# EAGLE design Breakout (EAGLE 9.6.2)

## Sheet 1 of 2
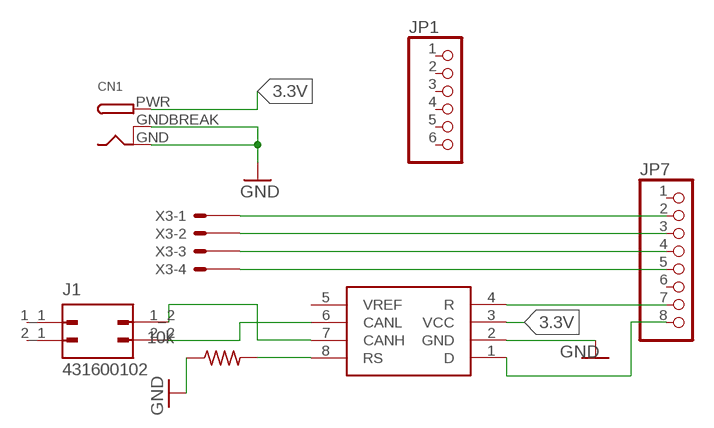
[diagram p0: schematic, sheet 1]

### Parts
CN1  DCBARRELPTH  [DCJACK_2MM_PTH]
IC1  SN65HVD231D  [SOIC127P600X175-8N]
J1  431600102  [MOLEX_431600102]
JP1  PINHD-1X6  [1X06]
JP7  PINHD-1X8  [1X08]
R5  10k  R-US_0204/5  [0204/5]
X3  43160-5304  [43160-XX04]

### Nets
3.3V: CN1.PWR IC1.3(VCC)
GND: CN1.GND CN1.GNDBREAK IC1.2(GND) R5.1
N$1: IC1.1(D) JP7.8
N$2: IC1.4(R) JP7.7
N$5: IC1.8(RS) R5.2
N$6: JP7.5 X3.4@1(-4:S)
N$7: JP7.4 X3.3@1(-3:S)
N$8: JP7.3 X3.2@1(-2:S)
N$9: JP7.2 X3.1@1(-1:S)
SIG_N: IC1.6(CANL) J1.2_2
SIG_P: IC1.7(CANH) J1.1_2
Unconnected: IC1.5(VREF) J1.1_1 J1.2_1 JP1.1 JP1.2 JP1.3 JP1.4 JP1.5 JP1.6 JP7.1 JP7.6 X3.1@2(-1:S) X3.2@2(-2:S) X3.3@2(-3:S) X3.4@2(-4:S)

## Sheet 2 of 2

## Library data of the parts
CN1 = adafruit:DCBARREL: 2.0mm DC Barrel Jack DCJACK_2MM_PTH - Through Hole Jack (4UConnector: 05537)
IC1 = SN65HVD231D:SN65HVD231D: CAN Transceiver 1Mbit/s ISO 11898, Sleep-Mode, 8-Pin SOIC Source: Datasheet <http://www.ti.com/lit/ds/symlink/sn65hvd230.pdf>; ARROW_PART_NUMBER: SN65HVD231D; ARROW_PRICE-STOCK: https://www.arrow.com/en/products/sn65hvd231d/texas-instruments?region=nac; DESCRIPTION: CAN Transceiver 1Mbit/s ISO 11898, Sleep-Mode, 8-Pin SOIC; HEIGHT: 1.75mm; MANUFACTURER_NAME: Texas Instruments; MANUFACTURER_PART_NUMBER: SN65HVD231D; MOUSER_PART_NUMBER: 595-SN65HVD231D; MOUSER_PRICE-STOCK: https://www.mouser.co.uk/ProductDetail/Texas-Instruments/SN65HVD231D?qs=QViXGNcIEAsYeC9x726Emw%3D%3D
J1 = 431600102:431600102: Check availability <https://pricing.snapeda.com/parts/43160-0102/Molex/view-part?ref=eda>; AVAILABILITY: In Stock; DESCRIPTION: 2 Position Header, Male Blades Connector Solder 0.295 (7.50mm) Through Hole; MF: Molex; MP: 43160-0102; PACKAGE: None; PRICE: None; PURCHASE-URL: https://pricing.snapeda.com/search/part/43160-0102/?ref=eda
JP1 = pinhead:PINHD-1X6: PIN HEADER
JP7 = pinhead:PINHD-1X8: PIN HEADER
R5 = rcl:R-US_: RESISTOR, American symbol; SPICEPREFIX: R
X3 = con-molex:43160-*04: SDA-43160 Connector Source: http://www.molex.com/pdm_docs/sd/431601306_sd.pdf; MF: MOLEX; MPN: 43160-5304; OC_FARNELL: unknown; OC_NEWARK: 92M1500

## Board
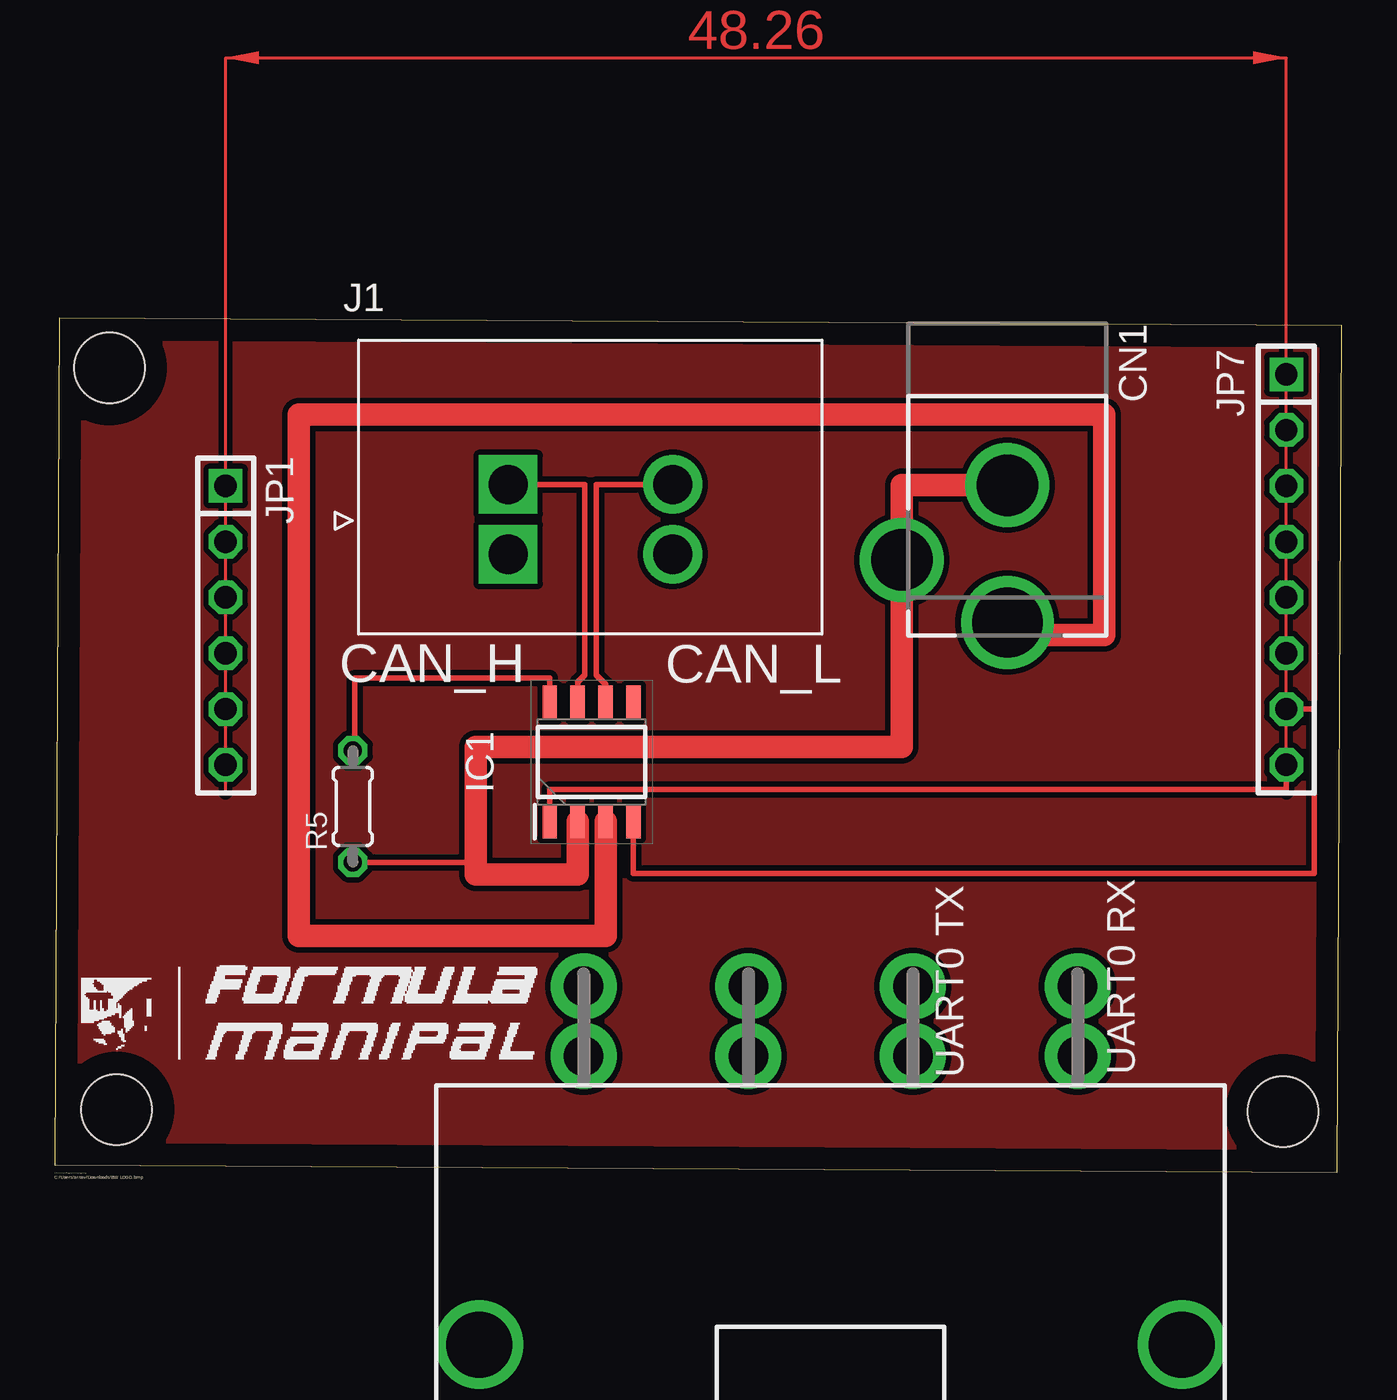
[diagram p1: board, top side]
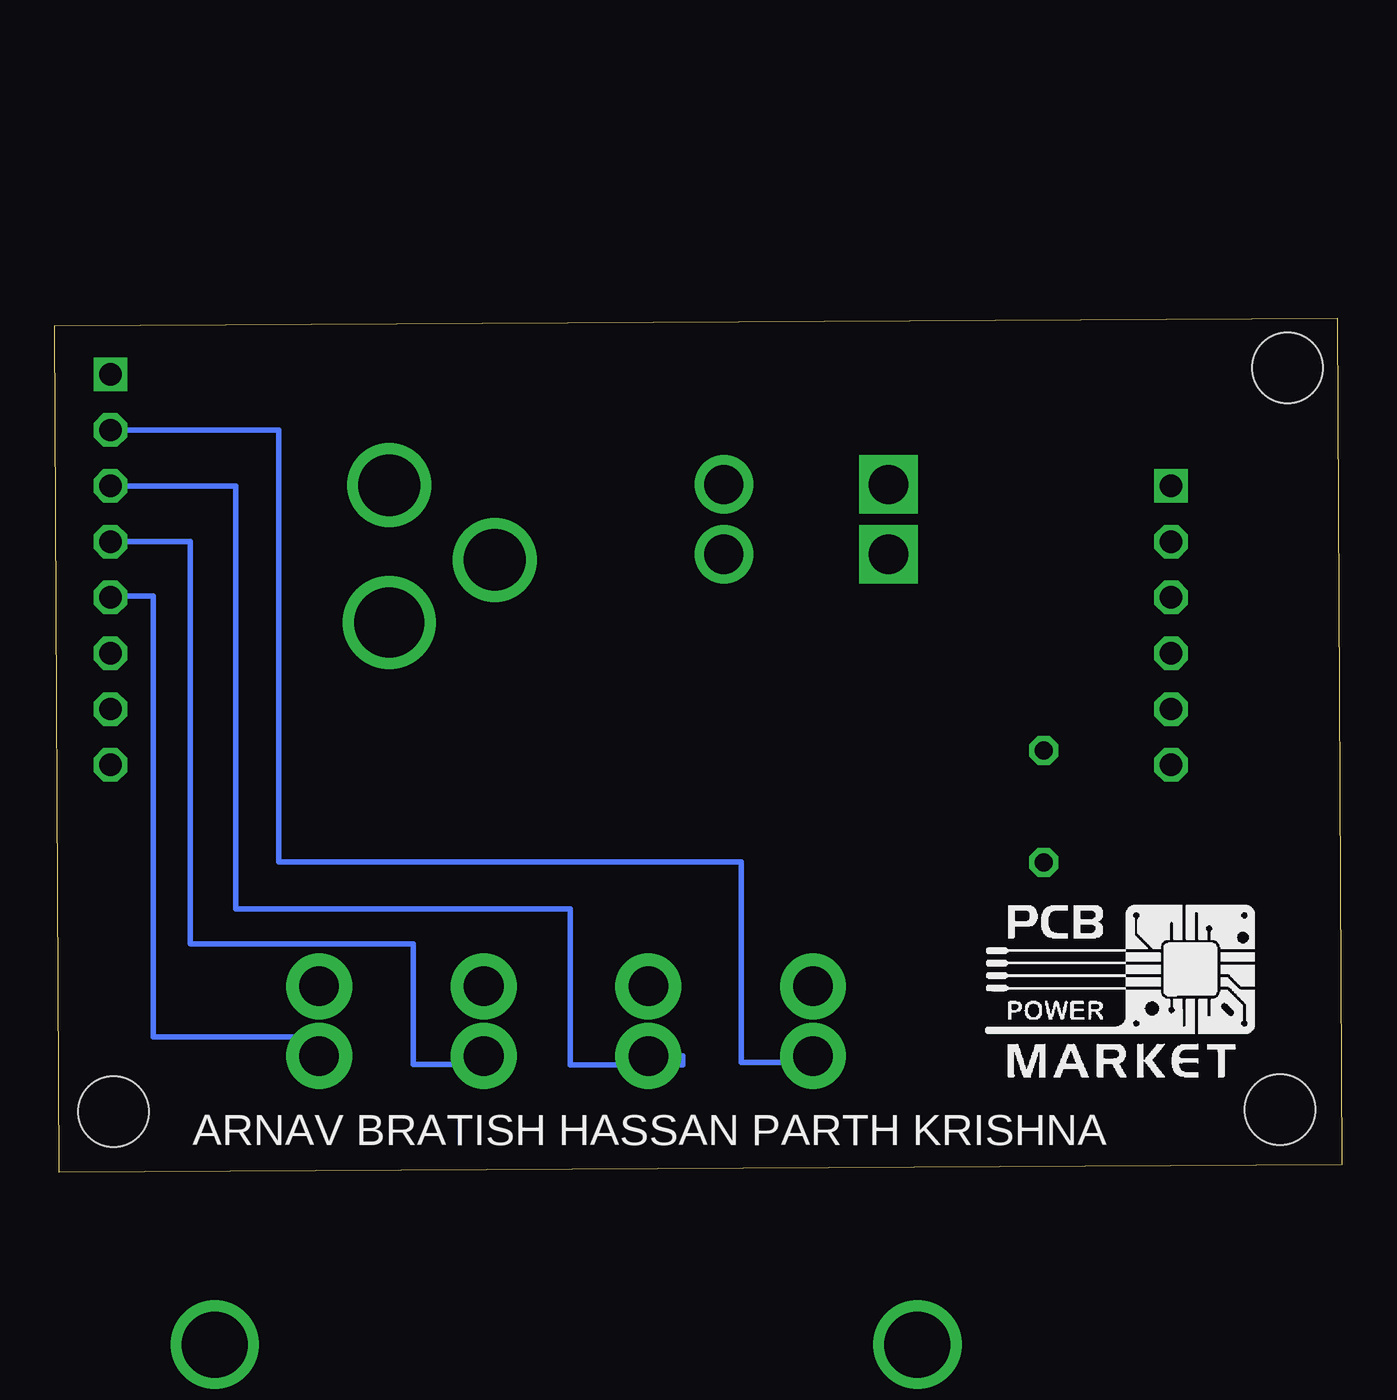
[diagram p2: board, bottom side, seen from below]

Size 58.54 x 38.88 mm. Coordinates in mm from the lower left corner, seen from the top.
Outline: 0,0.35 58.34,0 58.54,38.53 0.2,38.88 0,0.35
Copper layers (1*16): Top 0.035mm / dielectric 1.5mm / Bottom 0.035mm
Design rules "default *": minimum track width 10mil, minimum drill 0.35mm, track to track 10mil, track to pad 10mil, pad to pad 10mil, via to via 10mil, smd to smd 10mil, copper to edge 40mil, drill to drill 10mil, minimum pad ring 10mil, minimum via ring 8mil, stop-mask expansion 4mil, vias tented up to drill 0mil, thermal gap 10mil
Holes 3.2 mm at 2.47,36.61 2.8,2.86 55.87,2.75

### Footprints (pad centres in the part's own frame; a part is rotated, then mirrored left to right if it is on the bottom)
DCJACK_2MM_PTH = drill 2.8: GND 0,7.35; GNDBREAK 4.8,10.75 | drill 3.2: PWR 0,13.6
SOIC127P600X175-8N = smd 1.528 x 0.65: 1 -2.711,1.905; 2 -2.711,0.635; 3 -2.711,-0.635; 4 -2.711,-1.905; 5 2.711,-1.905; 6 2.711,-0.635; 7 2.711,0.635; 8 2.711,1.905
MOLEX_431600102 = drill 1.78 pad 2.28 square: 1_1 0,0; 1_2 0,3.18 | drill 1.78 pad 2.28: 2_1 7.493,0; 2_2 7.493,3.18
1X06 = drill 1.016 square: 1 -6.35,0 | drill 1.016 octagon: 2 -3.81,0; 3 -1.27,0; 4 1.27,0; 5 3.81,0; 6 6.35,0
1X08 = drill 1.016 square: 1 -8.89,0 | drill 1.016 octagon: 2 -6.35,0; 3 -3.81,0; 4 -1.27,0; 5 1.27,0; 6 3.81,0; 7 6.35,0; 8 8.89,0
0204/5 = drill 0.813 octagon: 1 -2.54,0; 2 2.54,0
43160-XX04 = drill 1.8 pad 3: 1@1 -11.235,0; 1@2 -11.235,3.18; 2@1 -3.745,0; 2@2 -3.745,3.18; 3@1 3.745,0; 3@2 3.745,3.18; 4@1 11.235,0; 4@2 11.235,3.18 | drill 3 pad 3.4: M1 -15.985,-13.13; M2 15.985,-13.13

### Placement (x,y rotation side)
CN1  43.33,38.62 180 top
IC1  24.42,18.67 90 top
J1  20.62,28.13 0 top
JP1  7.76,24.89 270 top
JP7  56.02,27.43 270 top
R5  13.55,16.65 90 top
X3  35.29,5.29 0 top

### Tracks (layer width: path | path; a pad name or v marks a point on that pad's centre or on a via)
3.3V
  Top 1.016: IC1.3 25.05,10.75 11.09,10.75 11.09,34.48 47.74,34.48 47.74,24.44 43.33,24.44 CN1.PWR
GND
  Top 0.254: R5.1 19.14,14.11 19.14,14.26
  Top 1.016: CN1.GND 38.53,31.27 CN1.GNDBREAK 38.53,19.36 19.14,19.36 19.14,14.26 19.14,13.55 23.78,13.55 IC1.2
N$1
  Top 0.254: JP7.8 56.02,17.43 22.51,17.43 IC1.1
N$2
  Top 0.254: IC1.4 26.32,13.6 57.29,13.6 57.29,21.08 JP7.7
N$5
  Top 0.254: IC1.8 22.51,22.49 13.63,22.49 13.63,19.19 R5.2
N$6
  Bottom 0.254: X3.4@1 46.52,6.15 54.07,6.15 54.07,26.22 56.02,26.22 JP7.5
N$7
  Bottom 0.254: JP7.4 52.39,28.7 52.39,10.42 52.37,10.4 42.23,10.4 42.23,4.91 39.67,4.91 39.64,4.94 | 40.07,4.94 39.64,4.94 | 39.64,4.94 39.03,4.94 X3.3@1
N$8
  Bottom 0.254: JP7.3 50.31,31.24 50.31,12 35.1,12 35.1,4.88 29.99,4.88 29.99,5.29 X3.2@1
N$9
  Bottom 0.254: X3.1@1 24.05,5.01 27.32,5.01 27.32,14.13 48.35,14.13 48.35,33.78 JP7.2
SIG_N
  Top 0.254: IC1.6 25.05,22.21 24.62,22.64 24.62,31.31 J1.2_2
SIG_P
  Top 0.254: IC1.7 23.78,22.31 24.11,22.64 24.11,31.31 J1.1_2
VCC
  pour Top: 0.1,38.86 0.1,0.13 58.56,0.13 58.56,38.86
(copper drawn outside any net)
  shapes: Top area x1

### Text on the board
tPlace: CAN_H | CAN_L | UART0 TX | UART0 RX | C:/Users/arnav/Downloads/BW LOGO.bmp | C:/Users/arnav/Downloads/blacklkkaaa.bmp | C:/Users/arnav/Downloads/onlylogo.bmp
bPlace: ARNAV BRATISH HASSAN PARTH KRISHNA | C:/FORMULAMANIPAL/PCB designs/Logo/FlipPower.bmp